# Altium project MainBoard.PrjPcb (part 1 of 2)
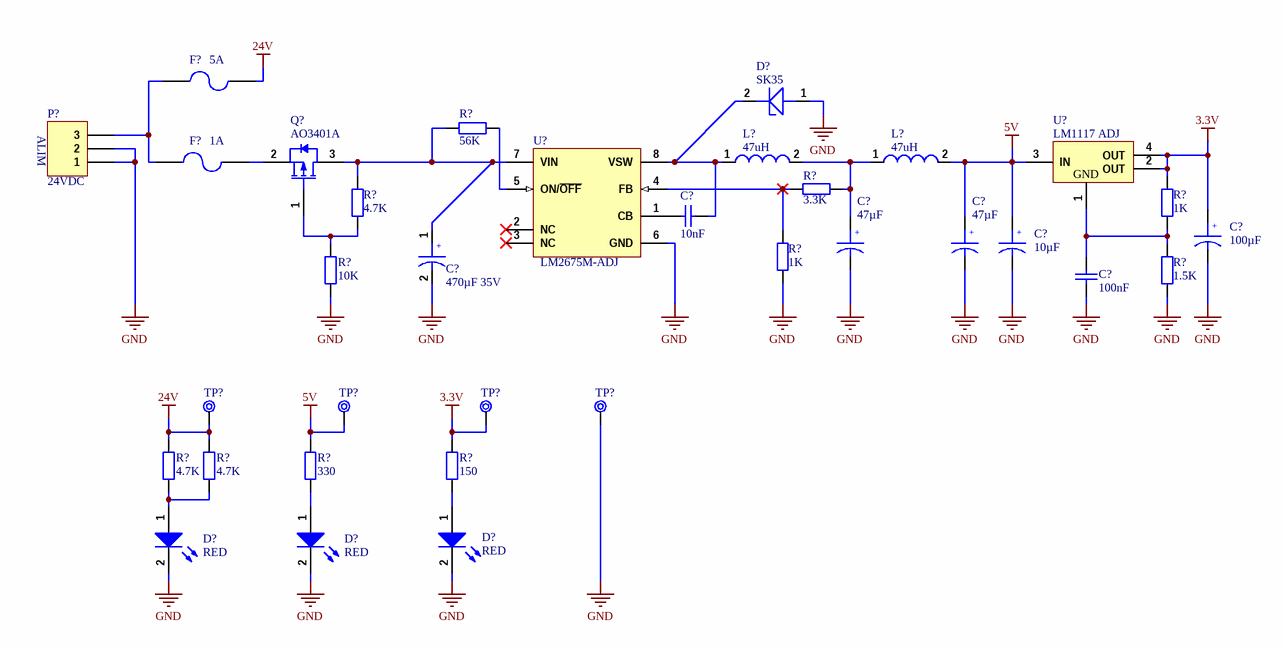
[diagram p0: PSU.SchDoc]
4 sheets, 97 parts. Net scope: flat (ports and power ports of the same name join across sheets).
Sheets:
  PSU.SchDoc
  AFFICHEUR.SchDoc
  MDB.SchDoc
  KEYBOARD.SchDoc

## Sheet PSU.SchDoc: POWER SUPPLY 3.3V
size A4; Date: 16 02 2016; Author: Rachid AKKOUCHE; CompanyName: RASoftware; DrawnBy: Rachid AKKOUCHE; Engineer: Rachid AKKOUCHE; Organization: RASoftware; Address1: 52J-03 rue de la crèche; Address3: 77100 MEAUX; Address4: FRANCE; DocumentNumber: BRA201909268; Revision: II; SheetNumber: 1; SheetTotal: 3; Dessinepar: Rachid AKKOUCHE; Property: RASoftware; Time: 08:00

### Parts
(Parts that share a designator on the sheet are numbered #1, #2 ... from top to bottom, then left to right.)
C?#1  10nF  [C 0805(2012)x0.65]
C?#2  100µF  [Kemet_63]
C?#3  470µF 35V  [KEMET_10]
C?#4  47µF  [CAP TANT 35X28]
C?#5  47µF  [CAP TANT 35X28]
C?#6  10µF  [KEMET_4 - 2]
C?#7  100nF  [C 0805(2012)x0.65]
D?#1  SK35  [SMA]
D?#2  Couleur: RED  [0603-LEDR]  (hidden comment: HSMH-C190)
D?#3  Couleur: RED  [0603-LEDR]  (hidden comment: HSMH-C190)
D?#4  Couleur: RED  [0603-LEDR]  (hidden comment: HSMH-C190)
F?#1  5A  [FUS5X20]
F?#2  1A  [FUS5X20]
L?#1  47uH  [Self DO3316P]
L?#2  47uH  [Self DO3316P]
P?#1  24VDC  [CO3P381 - RIGHT]
Q?#1  AO3401A  [SOT23]
R?#1  56K  [R 0805(2012)]
R?#2  4.7K  [R 0805(2012)]
R?#3  1K  [R 0805(2012)]
R?#4  3.3K  [R 0805(2012)]
R?#5  1K  [R 0805(2012)]
R?#6  10K  [R 0805(2012)]
R?#7  1.5K  [R 0805(2012)]
R?#8  4.7K  [R 0805(2012)]
R?#9  4.7K  [R 0805(2012)]
R?#10  330  [R 0805(2012)]
R?#11  150  [R 0805(2012)]
TP?#1  TEST PIN  [tp]  (value not drawn)
TP?#2  TEST PIN  [tp]  (value not drawn)
TP?#3  TEST PIN  [tp]  (value not drawn)  (no BOM)
TP?#4  TEST PIN  [tp]  (value not drawn)  (no BOM)
U?#1  LM1117 ADJ  [SOT223]
U?#2  LM2675M-ADJ  [SOIC8]

### Nets
3.3V: C?#2.1 R?#3.2 R?#11.2 TP?#3.1 U?#1.2(OUT) U?#1.4(OUT)
5V: C?#5.1 C?#6.1 L?#2.2 R?#10.2 TP?#2.1 U?#1.3(IN)
24V: F?#1.2 R?#8.2 R?#9.2 TP?#1.1
GND: C?#2.2 C?#3.2 C?#4.2 C?#5.2 C?#6.2 C?#7.1 D?#1.1(ANOD) D?#2.2(K) D?#3.2(K) D?#4.2(K) P?#1.1 P?#1.2 R?#5.1 R?#6.1 R?#7.1 TP?#4.1 U?#2.6(GND)
NetC?#1_1: C?#1.1 D?#1.2(CATH) L?#1.1 U?#2.8(VSW)
NetC?#1_2: C?#1.2 U?#2.1(CB)
NetC?#3_1: C?#3.1 Q?#1.3(D) R?#1.1 R?#2.2 U?#2.7(VIN)
NetC?#4_1: C?#4.1 L?#1.2 L?#2.1 R?#4.1
NetC?#7_2: C?#7.2 R?#3.1 R?#7.2 U?#1.1(GND)
NetD?#2_1: D?#2.1(A) R?#8.1 R?#9.1
NetD?#3_1: D?#3.1(A) R?#10.1
NetD?#4_1: D?#4.1(A) R?#11.1
NetF?#1_1: F?#1.1 F?#2.1 P?#1.3
NetF?#2_2: F?#2.2 Q?#1.2(S)
NetQ?#1_1: Q?#1.1(G) R?#2.1 R?#6.2
NetR?#1_2: R?#1.2 U?#2.5(ON/~{OFF})
NetR?#4_2: R?#4.2 R?#5.2 U?#2.4(FB)

Not connected (* = marked no-connect by the designer): U?#2 2(NC)* 3(NC)*

### Notes on the sheet
- (near P?#1) ALIM
- Project:
- Il ne peut être divulgué sans l'accord écrit de l'un de ses représentants dûment mandaté
- Ce document est la propriété de
- Title:
- Number:
- Date:
- Time:
- Size:
- A4
- Revision:
- Sheet
- of
- 2, rue Georges MELIES
- Draw by:
- 78390 BOIS D'ARCY
- (in symbol Cap Pol 10µF) +
- (in symbol Cap Pol 100µF) +
- (in symbol Cap Pol 470 µf) +
- (in symbol Cap tantale 47µF) +

### Library data of the parts
C?#1 = Cap 0805 10nF: Capacitor 10nF; Manufacturer: AVX; Manufacturer Part Number: 0402YC103KAT2A; Unit: pcs; SuppliedAmount: 0; MinAmount: 200; Multiples: 100; Type de condensateur: céramique; Tye de condensateur: MLCC; Tension de travail: 16V; Diélectrique: X7R; Tolérance: ±10%; Montage: SMD; Boîtier: 0402; Température de travail: -55...125°C; Supplier Part Number 1: 0402YC103KAT2A; ComponentLink1URL: http://www.tme.eu/fr/details/0402yc103kat2a/condensateurs-mlcc-smd-0402/avx/; ComponentLink1Description: http://www.tme.eu/fr/details/0402yc103kat2a/condensateurs-mlcc-smd-0402/avx/; Category: Condensateurs MLCC SMD 0402; Stock: 41500; Weight: 0,014; Price Type: NET; Capacité: 10nF; Fabricant: AVX; Supplier 1: TME
C?#2 = Cap Pol 100µF: Polarized Capacitor; Manufacturer: EPCOS; Manufacturer Part Number: B41142A4107M; Product Range: EPCOS - B41142 Series; Capacité: 100; Tolérance de capacité: ± 20%; Tension: 16; Type de boîtier de condensateur: Radial Can - SMD; Diamètre: 6.3; Résistance, ESR: 0.16; Hauteur: 7.7; Courant d'ondulation c.a.: 300; Type de packaging: Cut Tape; Durée de vie @ température: 2000 heures @ 105; Température d'utilisation min: -55; Température de fonctionnement max..: 105; SVHC: No SVHC (19-Dec-2012); Impédance: 0.26; Température de fonctionnement: -55°C à +105; Température, ESR: 20; Type de boîtier: CMS; Supplier 1: Farnell; RoHS: YES; Pricing 1: 10=0,123, 50=0,095, 100=0,078, 250=0,07, 1000=0,062 (EUR); Courant d'ondulation c.a. à  100Hz: 300; Fréquence, impédance: 100; Longueur/hauteur: 7.7; Température, courant ondulatoire: 105; Température, impédance: 20; ComponentLink1URL: http://www.epcos.com/inf/20/30/db/alu_x/B41142.pdf; ComponentLink1Description: http://www.epcos.com/inf/20/30/db/alu_x/B41142.pdf; Supplier Part Number 1: 1735328
C?#3 = Cap Pol 470 µf: Polarized capacitor; Manufacturer: Panasonic; Manufacturer Part Number: EEV-FK1V471Q; Material: Aluminium; Capacitance: 470uF; Tolerance: 20%; Ripple Current (AC): 1.1A; Impedance: 60mR; Life (Hours): 5000Hour; Leakage Current: 3uA; Dissipation Factor: 0.12%; ComponentLink1URL: http://www.farnell.com/datasheets/1680956.pdf; ComponentLink1Description: http://www.farnell.com/datasheets/1680956.pdf; Supplier 1: Farnell; Stock 1: 0; Mount: Surface Mount,PCB; Case/Package: Radial; Contact Plating: Tin; Min Operating Temperature: -55°C; Max Operating Temperature: 105°C; Voltage Rating: 35V; Packaging: Tape and Reel; Ripple Current: 1.1A; Package Quantity: 200; Voltage Rating (DC): 35V; ESR (Equivalent Series Resistance): 60mR; Termination: SMD/SMT; Voltage: 35V; Diameter: 12.5mm; Length: 13.5mm; Height: 13.5mm; Height - Seated (Max): 0.531inch; Width: 900um; Radiation Hardening: No; REACH SVHC: No SVHC; Lead Free: Lead Free; ComponentLink2URL: https://datasheet.ciiva.com/11783/0900766b80e4e8b0-11783536.pdf; ComponentLink2Description: https://datasheet.ciiva.com/11783/0900766b80e4e8b0-11783536.pdf; ComponentLink3URL: https://datasheet.ciiva.com/29313/443482-da-01-en-smd-elko-vfk-h13-470-uf-35v-29313589.pdf; ComponentLink3Description: https://datasheet.ciiva.com/29313/443482-da-01-en-smd-elko-vfk-h13-470-uf-35v-29313589.pdf; ComponentLink4URL: https://datasheet.ciiva.com/48483/aba0000ce120-48483341.pdf; ComponentLink4Description: https://datasheet.ciiva.com/48483/aba0000ce120-48483341.pdf; ComponentLink5URL: https://datasheet.ciiva.com/30252/eev-fkseries-30252141.pdf; ComponentLink5Description: https://datasheet.ciiva.com/30252/eev-fkseries-30252141.pdf; ComponentLink6URL: https://datasheet.ciiva.com/15225/getdatasheetpartid-199809-15225692.pdf; ComponentLink6Description: https://datasheet.ciiva.com/15225/getdatasheetpartid-199809-15225692.pdf; ComponentLink7URL: https://datasheet.ciiva.com/14599/70258115-14599980.pdf; ComponentLink7Description: https://datasheet.ciiva.com/14599/70258115-14599980.pdf; ComponentLink8URL: https://datasheet.ciiva.com/28692/1676921-28692730.pdf; ComponentLink8Description: https://datasheet.ciiva.com/28692/1676921-28692730.pdf; ComponentLink9URL: https://datasheet.ciiva.com/14592/70258115-14592362.pdf; ComponentLink9Description: https://datasheet.ciiva.com/14592/70258115-14592362.pdf; ComponentLink10URL: https://datasheet.ciiva.com/14592/70068597-14592122.pdf; ComponentLink10Description: https://datasheet.ciiva.com/14592/70068597-14592122.pdf; ComponentLink11URL: https://datasheet.ciiva.com/2984/aba0000ce120-2984090.pdf; ComponentLink11Description: https://datasheet.ciiva.com/2984/aba0000ce120-2984090.pdf; ComponentLink12URL: https://datasheet.ciiva.com/8081/1676921-8081433.pdf; ComponentLink12Description: https://datasheet.ciiva.com/8081/1676921-8081433.pdf; ComponentLink13URL: https://datasheet.ciiva.com/46379/1676921-46379192.pdf; ComponentLink13Description: https://datasheet.ciiva.com/46379/1676921-46379192.pdf; ComponentLink14URL: https://datasheet.ciiva.com/24229/aba0000ce120-24229287.pdf; ComponentLink14Description: https://datasheet.ciiva.com/24229/aba0000ce120-24229287.pdf; ComponentLink15URL: https://datasheet.ciiva.com/31417/1676921-31417910.pdf; ComponentLink15Description: https://datasheet.ciiva.com/31417/1676921-31417910.pdf; ComponentLink16URL: https://datasheet.ciiva.com/43470/1676921-43470869.pdf; ComponentLink16Description: https://datasheet.ciiva.com/43470/1676921-43470869.pdf; ComponentLink17URL: https://datasheet.ciiva.com/17355/aba0000ce120-17355694.pdf; ComponentLink17Description: https://datasheet.ciiva.com/17355/aba0000ce120-17355694.pdf; ComponentLink18URL: https://datasheet.ciiva.com/46372/1676921-46372495.pdf; ComponentLink18Description: https://datasheet.ciiva.com/46372/1676921-46372495.pdf; Supplier Part Number 1: 2326374RL
C?#4 C?#5 = Cap tantale 47µF: Capacitor tantale 47µF; Manufacturer: KEMET; Manufacturer Part Number: T491B106K020AT; Dielectric Material: Tantalum; Capacitance: 10uF; Tolerance: 10%; ESR (Equivalent Series Resistance): 2.1R; Voltage Rating: 20V; Ripple Current: 201mA; Leakage Current: 2uA; Polarity: Polar; Dissipation Factor: 6%; Life (Hours): 2000Hour; RoHS: Yes; Mount: Surface Mount,PCB; Case/Package: 1411; Number of Pins: 2; Weight: 0.002293oz; Case Code (Metric): 3528; Case Code (Imperial): 1411; Min Operating Temperature: -55°C; Max Operating Temperature: 125°C; Packaging: Tape and Reel; Package Quantity: 1; Voltage Rating (DC): 20V; Termination: SMD/SMT; Failure Rate: 0.001%; Voltage: 20V; Features: General Purpose; Length: 3.5mm; Height: 1.9mm; Width: 2.8mm; Height - Seated (Max): 0.083inch; Depth: 2.8mm; Radiation Hardening: No; REACH SVHC: No SVHC; Lead Free: Lead Free; ComponentLink1URL: https://datasheet.ciiva.com/34302/1573513-34302517.pdf?src-supplier=Jameco; ComponentLink1Description: https://datasheet.ciiva.com/34302/1573513-34302517.pdf?src-supplier=Jameco; ComponentLink2URL: https://datasheet.ciiva.com/11793/0900766b80718482-11793045.pdf?src-supplier=RSComponents; ComponentLink2Description: https://datasheet.ciiva.com/11793/0900766b80718482-11793045.pdf?src-supplier=RSComponents; ComponentLink3URL: https://datasheet.ciiva.com/5933/1446014-5933945.pdf?src-supplier=Farnell; ComponentLink3Description: https://datasheet.ciiva.com/5933/1446014-5933945.pdf?src-supplier=Farnell; ComponentLink4URL: https://datasheet.ciiva.com/5934/kem-t2005-t491-5934250.pdf?src-supplier=Farnell; ComponentLink4Description: https://datasheet.ciiva.com/5934/kem-t2005-t491-5934250.pdf?src-supplier=Farnell; ComponentLink5URL: https://datasheet.ciiva.com/18095/getdatasheetpartid-74405-18095116.pdf?src-supplier=Verical; ComponentLink5Description: https://datasheet.ciiva.com/18095/getdatasheetpartid-74405-18095116.pdf?src-supplier=Verical; ComponentLink6URL: https://datasheet.ciiva.com/7851/1854511-7851182.pdf?src-supplier=Element14; ComponentLink6Description: https://datasheet.ciiva.com/7851/1854511-7851182.pdf?src-supplier=Element14; ComponentLink7URL: https://datasheet.ciiva.com/7851/1854511-7851183.pdf?src-supplier=Element14; ComponentLink7Description: https://datasheet.ciiva.com/7851/1854511-7851183.pdf?src-supplier=Element14; ComponentLink8URL: https://datasheet.ciiva.com/6228/kem-t2005-t491-6228165.pdf?src-supplier=Digi-Key; ComponentLink8Description: https://datasheet.ciiva.com/6228/kem-t2005-t491-6228165.pdf?src-supplier=Digi-Key; ComponentLink9URL: https://datasheet.ciiva.com/12911/kem-t2005-t491-12911733.pdf?src-supplier=Mouser; ComponentLink9Description: https://datasheet.ciiva.com/12911/kem-t2005-t491-12911733.pdf?src-supplier=Mouser; ComponentLink10URL: https://datasheet.ciiva.com/8080/kem-t2005-t491-8080268.pdf?src-supplier=Element14; ComponentLink10Description: https://datasheet.ciiva.com/8080/kem-t2005-t491-8080268.pdf?src-supplier=Element14
C?#6 = Cap Pol 10µF: Polarized Capacitor; Manufacturer: KEMET; Manufacturer Part Number: EXV106M025A9BAA; Supplier 1: Farnell; Supplier Part Number 1: 2069174; RoHS: YES; Pricing 1: 10=0,111, 100=0,085, 500=0,074, 1000=0,07, 5000=0,066 (EUR); ComponentLink1URL: http://www.farnell.com/datasheets/1500293.pdf; ComponentLink1Description: http://www.farnell.com/datasheets/1500293.pdf
C?#7 = Cap 0805 100nF: Capacitor; Manufacturer: MULTICOMP; Manufacturer Part Number: MCCA000296; Supplier 1: Farnell; Supplier Part Number 1: 1759167; Pricing 1: 100=0,01, 500=0,008, 1000=0,006, 4000=0,005 (EUR); ComponentLink1URL: http://www.farnell.com/datasheets/1520827.pdf; ComponentLink1Description: http://www.farnell.com/datasheets/1520827.pdf
D?#1 = SS14: Diode schottky 50V 3A; Manufacturer 1: Fairchild Semiconductor; Description 1: DIODE SCHOTTKY 40V 1A SMA; Forward Current: 1; Max Repetitive Reverse Voltage (Vrrm): 40; Element Configuration: Single; Forward Voltage: 500; Peak Reverse Current: 200; Polarity: Standard; Max Power Dissipation: 1.1; Supplier 1: Farnell; Supplier Part Number 1: 1467537RL; Manufacturer Part Number 1: SS14; Stock 1: 21745; Pricing 1: 1=0.305, 80=0.104, 300=0.0774, 700=0.0561, 2000=0.051, 6000=0.0478 (GBP); Mount: Surface Mount; Case/Package: SMA; Number of Pins: 2; Weight: 0.003739; Number of Terminals: 2; Min Operating Temperature: -65; Max Operating Temperature: 125; Packaging: Tape and Reel; Package Quantity: 7500; Max Forward Surge Current (Ifsm): 40; Current Rating: 1; Peak Non-Repetitive Surge Current: 40; Termination: SMD/SMT; Voltage Rating (DC): 40; Reverse Voltage (DC): 40; Average Rectified Current: 1; Output Current: 1; Current: 1; Voltage: 40; Number of Elements: 1; Power Dissipation: 1.1; Length: 4.75; Height: 2.2; Width: 2.95; Radiation Hardening: No; REACH SVHC: No SVHC; Lead Free: Lead Free; ComponentLink1URL: https://datasheet.ciiva.com/16744/ss14-16744879.pdf; ComponentLink1Description: https://datasheet.ciiva.com/16744/ss14-16744879.pdf; ComponentLink2URL: https://datasheet.ciiva.com/34301/1089027-34301973.pdf; ComponentLink2Description: https://datasheet.ciiva.com/34301/1089027-34301973.pdf; ComponentLink3URL: https://datasheet.ciiva.com/4713/ss14-197224-4713938.pdf; ComponentLink3Description: https://datasheet.ciiva.com/4713/ss14-197224-4713938.pdf; ComponentLink4URL: https://datasheet.ciiva.com/7965/1766303-7965241.pdf; ComponentLink4Description: https://datasheet.ciiva.com/7965/1766303-7965241.pdf; ComponentLink5URL: https://datasheet.ciiva.com/910/ss12-910696.pdf; ComponentLink5Description: https://datasheet.ciiva.com/910/ss12-910696.pdf; ComponentLink6URL: https://datasheet.ciiva.com/22651/1880990-22651980.pdf; ComponentLink6Description: https://datasheet.ciiva.com/22651/1880990-22651980.pdf; ComponentLink7URL: https://datasheet.ciiva.com/910/ss12-910697.pdf; ComponentLink7Description: https://datasheet.ciiva.com/910/ss12-910697.pdf; ComponentLink8URL: https://datasheet.ciiva.com/8303/ss19-8303766.pdf; ComponentLink8Description: https://datasheet.ciiva.com/8303/ss19-8303766.pdf; ComponentLink9URL: https://datasheet.ciiva.com/910/ss12-910695.pdf; ComponentLink9Description: https://datasheet.ciiva.com/910/ss12-910695.pdf; ComponentLink10URL: https://datasheet.ciiva.com/25951/ss19-25951496.pdf; ComponentLink10Description: https://datasheet.ciiva.com/25951/ss19-25951496.pdf
D?#2-D?#4 = HSMH-C190: Surface Mount Chip LED, Red; Manufacturer: AVAGO TECHNOLOGIES; Manufacturer Part Number: HSMH-C190.; Taille de lampe: 0.8mm x 1; Couleur de LED: Rouge; Intensité lumineuse: 17; Angle, vision: 170°; Courant, direct, If: 20; Tension, direct à  If: 1.8; Montage LED: CMS; Forme de lentille: Rectangulaire; Longueur d'onde typ.: 626; SVHC: No SVHC (19-Dec-2012); Dissipation de puissance: 65; Intensité lumineuse min. à  If: 2.8; Intensité lumineuse typique: 10; Largeur (externe): 0.8; Longueur d'onde dominante: 639; Longueur d'onde, crête: 630; Longueur/hauteur: 1.6; Matière: AlGaAs; Nombre de broches: 2; Orientation de montage opto: Dessus; Orientation sortie de lumière: Top Emitting; Température de fonctionnement: -30°C à +85; Température de fonctionnement max..: 85; Température, stockage min.: -40; Température d'utilisation min: -30; Tension, Vf max..: 2.6; Tension, Vf min.: 2.1; Type de LED: Standard; Supplier 1: Farnell; Supplier Part Number 1: 8554641; RoHS: YES; Stock 1: 13902; Pricing 1: 5=0,06, 25=0,059, 100=0,057, 250=0,052, 500=0,047 (EUR); MSL: MSL 2A - 4 semaines; Couleur, LED: Rouge; Profondeur: 0.8; Température, stockage max..: 85; Tension, Vf typ.: 1.8; ComponentLink1URL: http://www.farnell.com/datasheets/313031.pdf; ComponentLink1Description: http://www.farnell.com/datasheets/313031.pdf; ComponentLink2URL: http://www.farnell.com/datasheets/55927.pdf; ComponentLink2Description: http://www.farnell.com/datasheets/55927.pdf
F?#1 F?#2 = Fuse 2: Fuse; Manufacturer: KEYSTONE; Manufacturer Part Number: 4527; Fusible 5X20: 1123209; Published: 8-Jun-2000; LatestRevisionDate: 17-Jul-2002; LatestRevisionNote: Re-released for DXP Platform.; PackageReference: PIN-W2/E2.8; Publisher: Altium Limited; PackageDescription: Thru-Hole; 2 Leads; Supplier 1: Farnell; Supplier Part Number 1: 2301274+2301275+1123183; RoHS: YES; Pricing 1: 1=0,59, 250=0,45, 500=0,4, 1000=0,36, 5000=0,33 (EUR); ComponentLink1URL: http://www.keyelco.com/userAssets/file/M60p42.pdf; ComponentLink1Description: http://www.keyelco.com/userAssets/file/M60p42.pdf
L?#1 L?#2 = SELF: Manufacturer: COILCRAFT; Manufacturer Part Number: DO3316P-473MLD; Product Range: DO3316; Inductance: 47; RMS Current (Irms): 1.8; Saturation Current (Isat): 1.6; Inductor Construction: Unshielded; DC Resistance Max: 0.14; Power Inductor Case: 12.95mm x 9.4mm x 5.21; Inductance Tolerance: ± 20%; SVHC: No SVHC (12-Jan-2017); Self Resonant Frequency Min: 12MHz<!--FANDB--><div class="features-and-benefits-container"><div class="features-and-benefits-description"><span class="features-benefits-value">The DO3316P-473MLD is a surface mount unshielded Power Inductor with ferrite core. This inductor features gold over nickel over phosphor bronze terminations and is resistance to soldering heat maximum three 40 seconds reflows at +260°C, parts cooled to room temperature between cycles. This inductor also features moisture sensitivity level (MSL) of 1, failures in time (FIT)/mean time between failures (MTBF) is 38 per billion hours/26,315,789 hours, calculated per Telcordia SR-332 and only pure water or alcohol recommended for wash. Current at 25°C causes an inductance drop of 10% typical from its value without current. ±20; Supplier 1: Farnell; Supplier Part Number 1: 2287252; RoHS: YES; Stock 1: 2601; Pricing 1: 1=0.981, 500=0.722 (GBP); Packaging: Cut Tape; ComponentLink1URL: http://www.farnell.com/datasheets/1681904.pdf; ComponentLink1Description: http://www.farnell.com/datasheets/1681904.pdf
P?#1 = Header 3: Header, 3-Pin; Manufacturer: TE CONNECTIVITY / BUCHANAN; Manufacturer Part Number: 796636-3; LatestRevisionDate: 17-Jul-2002; LatestRevisionNote: Re-released for DXP Platform.; Publisher: Altium Limited; Supplier 1: Farnell; Supplier Part Number 1: 2059780; RoHS: YES; Pricing 1: 10=0,68, 100=0,51, 500=0,43, 1000=0,36, 2000=0,35, 5000=0,33 (EUR); ComponentLink1URL: http://www.farnell.com/cad/1652960.pdf; ComponentLink1Description: http://www.farnell.com/cad/1652960.pdf; ComponentLink2URL: http://www.farnell.com/datasheets/1650926.pdf; ComponentLink2Description: http://www.farnell.com/datasheets/1650926.pdf
Q?#1 = AO3401A: MOSFET P-CH 30V 4A SOT23; Manufacturer: Alpha & Omega Semiconductor; Rds On Max: 44mR; Input Capacitance: 1.2nF; Max Power Dissipation: 1.4W; Number of Elements: 1; Supplier 1: Arrow Electronics; Manufacturer Part Number: AO3401A; RoHS: Yes; Category: MOSFETs; Pricing 1: 6000=0,07860, 15000=0,06960, 30000=0,06870, 75000=0,05840, 150000=0,05610, 6000=0,08240, 60000=0,07800, 600000=0,05360, 3000000=0,04250, 6000000=0,04240 (USD); Mount: Surface Mount; Case/Package: TO-236-3; Number of Pins: 3; Min Operating Temperature: -55°C; Max Operating Temperature: 150°C; Packaging: Tape and Reel; Drain to Source Voltage (Vdss): 30V; Continuous Drain Current (ID): 4A; Power Dissipation: 1.4W; Series: -; Radiation Hardening: No; Lead Free: Lead Free; RoHS Compliant: Yes; ComponentLink1URL: https://datasheet.ciiva.com/940/ao3401a-940720.pdf?src-supplier=Digi-Key; ComponentLink1Description: https://datasheet.ciiva.com/940/ao3401a-940720.pdf?src-supplier=Digi-Key; ComponentLink2URL: https://datasheet.ciiva.com/26927/getdatasheetpartid-79048-26927888.pdf?src-supplier=Verical; ComponentLink2Description: https://datasheet.ciiva.com/26927/getdatasheetpartid-79048-26927888.pdf?src-supplier=Verical; Supplier Part Number 1: AO3401A
R?#1 = Resistor 0805 56K: Resistor SMD 0805 56K; Manufacturer: MULTICOMP; Manufacturer Part Number: MC0.1W08051%56KFR; Product Range: MULTICOMP - MC Series; Résistance: 56; Puissance: 100; Tolérance de résistance: ± 1%; Type de boîtier de résistance: 0805; Type de résistance: Couche épaisse; Coefficient de température: ± 100; Tension: 150; Type de packaging: Full Reel; Resistor Mounting: CMS; Resistor Terminals: (Non Disponible); Supplier 1: Farnell; RoHS: YES; Pricing 1: 5000=0,001 (EUR); MSL: (Non Applicable); ComponentLink1URL: http://www.farnell.com/datasheets/1716700.pdf; ComponentLink1Description: http://www.farnell.com/datasheets/1716700.pdf; Supplier Part Number 1: 2129258
R?#2 R?#8 R?#9 = Resistor 0805 4.7K: Resistor SMD 0805 4.7K; Manufacturer: MULTICOMP; Manufacturer Part Number: MC01W080514K7; Product Range: MULTICOMP - MC Series; Résistance: 4.7; Puissance: 100; Tolérance de résistance: ± 1%; Type de boîtier de résistance: 0805; Type de résistance: Couche épaisse; Coefficient de température: ± 100; Tension: 150; Type de packaging: Full Reel; SVHC: No SVHC (20-Jun-2013); Resistor Mounting: CMS; Supplier 1: Farnell; RoHS: YES; Pricing 1: 5000=0,001 (EUR); MSL: (Non Applicable); ComponentLink1URL: http://www.farnell.com/datasheets/1729047.pdf; ComponentLink1Description: http://www.farnell.com/datasheets/1729047.pdf; Supplier Part Number 1: 2129167
R?#3 R?#5 = Resistor 0805 1K: Resistor SMD 0805 1K; Manufacturer: MULTICOMP; Manufacturer Part Number: MC0.1W08051%1KFR; Product Range: MULTICOMP - MC Series; Résistance: 1; Puissance: 100; Tolérance de résistance: ± 1%; Type de boîtier de résistance: 0805; Type de résistance: Couche épaisse; Coefficient de température: ± 100; Tension: 150; Type de packaging: Full Reel; Resistor Mounting: CMS; ComponentLink1URL: http://www.farnell.com/datasheets/1716700.pdf; ComponentLink1Description: http://www.farnell.com/datasheets/1716700.pdf; Supplier 1: Farnell; RoHS: YES; Pricing 1: 5000=0,001 (EUR); MSL: MSL 1 - Illimité; Supplier Part Number 1: 2129113
R?#4 = Resistor 0805 3.3K: Resistor SMD 0805 3.3K; Manufacturer: BOURNS; Manufacturer Part Number: CR0805-FX-2201ELF; Resistance: 3.3kR; Power Rating: 125mW; Tolerance: 1%; Voltage Rating: 150V; Temperature Coefficient: 100ppm/°C; Supplier 1: Farnell; RoHS: YES; Stock 1: 2028; Pricing 1: 10=0.035, 100=0.0233, 500=0.0162, 1000=0.0141, 2500=0.012, 5000=0.0105, 25000=0.0065 (GBP); ComponentLink1URL: http://www.bourns.com/engineering/CHPREZTR/cr0805.stp; ComponentLink1Description: http://www.bourns.com/engineering/CHPREZTR/cr0805.stp; ComponentLink2URL: http://www.farnell.com/datasheets/2178762.pdf; ComponentLink2Description: http://www.farnell.com/datasheets/2178762.pdf; Supplier Part Number 1: 2333585; Supplier 2: Farnell; Stock 2: 0; Pricing 2: 150=0.004, 500=0.0029, 1000=0.0022, 2500=0.0018 (EUR); Mount: Surface Mount; Case/Package: 0805; Case Code (Metric): 2012; Case Code (Imperial): 0805; Packaging: Tape and Reel; Composition: Thick Film; Voltage Rating (DC): 150V; REACH SVHC: Unknown; ComponentLink3URL: https://datasheet.ciiva.com/46398/1849611-46398597.pdf; ComponentLink3Description: https://datasheet.ciiva.com/46398/1849611-46398597.pdf; Supplier Part Number 2: 2447651RL
R?#6 = Resistor 0805 10K: Resistor SMD 0805 10K; Manufacturer: MULTICOMP; Manufacturer Part Number: MC0.1W08051%10KFR; Product Range: MULTICOMP - MC Series; Résistance: 10; Puissance: 100; Tolérance de résistance: ± 1%; Type de boîtier de résistance: 0805; Type de résistance: Couche épaisse; Coefficient de température: ± 100; Tension: 150; Type de packaging: Full Reel; Resistor Mounting: CMS; Supplier 1: Farnell; RoHS: YES; Pricing 1: 5000=0,001 (EUR); MSL: MSL 1 - Illimité; ComponentLink1URL: http://www.farnell.com/datasheets/1716700.pdf; ComponentLink1Description: http://www.farnell.com/datasheets/1716700.pdf; Supplier Part Number 1: 2129195
R?#7 = Resistor 0805 1.5K: Resistor SMD 0805 1.5K; Power Rating: 125mW; Resistance: 1.5kR; Temperature Coefficient: 100ppm/°C; Tolerance: 1%; Voltage Rating: 150V; Case Code (Imperial): 0805; Case Code (Metric): 2012; Case/Package: 0805; Composition: Thick Film; Mount: Surface Mount; Packaging: Tape and Reel; REACH SVHC: Unknown; Voltage Rating (DC): 150V; Supplier 1: Farnell; Supplier Part Number 1: 2446909
R?#10 = Resistor 0805 330: Resistor SMD 0805 330; Manufacturer: YAGEO; Manufacturer Part Number: RC0805JR-07330RL; Unit: pcs; SuppliedAmount: 0; MinAmount: 100; Resistance: 330Ω; Power: 0.125W; Tolerance: ±5%; Max. operating voltage: 150V; Max. overload voltage: 300V; Supplier 1: TME; Category: 0805 SMD Resistors; Stock 1: 0; Pricing 1: 100=0.00553, 1000=0.00332, 5000=0.00109, 15000=0.001, 50000=0.00086 (EUR); Weight: 0.027; Multiples: 100; Resistor type: thick film; Mounting: SMD; Case: 0805; Operating temperature: -55...155°C; Price Type: NET; ComponentLink1URL: http://static.tme.eu/products_pics/6/6/c/66cc5cd64257edd80ca8e9fd2040972d/56038.jpg; ComponentLink1Description: http://static.tme.eu/products_pics/6/6/c/66cc5cd64257edd80ca8e9fd2040972d/56038.jpg; Supplier Part Number 1: RC0805JR-07330R
R?#11 = Resistor 0805 150: Resistor SMD 0805 150; Manufacturer: YAGEO; Manufacturer Part Number: RC0805JR-07150KL; Unit: pcs; SuppliedAmount: 0; MinAmount: 100; Resistance: 150kΩ; Power: 0.125W; Tolerance: ±5%; Max. operating voltage: 150V; Max. overload voltage: 300V; Supplier 1: TME; Category: 0805 SMD Resistors; Stock 1: 6800; Pricing 1: 100=0.00566, 1000=0.0034, 5000=0.00111, 15000=0.00102, 50000=0.00088 (EUR); Weight: 0.028; Multiples: 100; Resistor type: thick film; Mounting: SMD; Case: 0805; Operating temperature: -55...155°C; Price Type: NET; ComponentLink1URL: http://static.tme.eu/products_pics/6/6/c/66cc5cd64257edd80ca8e9fd2040972d/56038.jpg; ComponentLink1Description: http://static.tme.eu/products_pics/6/6/c/66cc5cd64257edd80ca8e9fd2040972d/56038.jpg; Supplier Part Number 1: RC0805JR-07150K
TP?#1 = TEST PIN: Point de test 12/485
TP?#2 = TEST PIN: Point de test 12
TP?#3 TP?#4 = TEST PIN: Point de test 3.3
U?#1 = LM1117DT-ADJ: 800mA Adjustable low-Dropout Linear Regulator, 3-pin TO-252; ComponentLink1URL: http://www.ti.com/lit/ds/symlink/tlv1117.pdf; ComponentLink1Description: http://www.ti.com/lit/ds/symlink/tlv1117.pdf; ComponentLink2URL: http://www.farnell.com/cad/1614300.zip; ComponentLink2Description: http://www.farnell.com/cad/1614300.zip
U?#2 = LM2675M-ADJ: SIMPLE SWITCHER® Power Converter High Efficiency 1A Step-Down Voltage Regulator, 8-pin Narrow SOIC; Manufacturer: Texas Instruments; Manufacturer Part Number: LM2675MX-ADJNOPB; Output Voltage: 37V; Number of Outputs: 1; Switching Frequency: 260kHz; Quiescent Current: 2.5mA; ComponentLink1Description: LM2675 Datasheet; ComponentLink1URL: http://www.national.com/ds/LM/LM2675.pdf; ComponentLink2Description: LM2675 Web Page; ComponentLink2URL: http://www.national.com/pf/LM/LM2675.html; ComponentLink3Description: M08A Package Page; ComponentLink3URL: http://www.national.com/packaging/folders/m08a.html; Supplier 1: Farnell; Stock 1: 0; Case/Package: SOIC N; Number of Pins: 8; Packaging: Cut Tape; Output Current: 1A; Lead Free: Lead Free; ComponentLink4URL: http://www.ti.com/lit/ds/symlink/lm2675.pdf; ComponentLink4Description: http://www.ti.com/lit/ds/symlink/lm2675.pdf; ComponentLink5URL: http://www.ti.com/lit/gpn/lm2675; ComponentLink5Description: http://www.ti.com/lit/gpn/lm2675; Supplier Part Number 1: 2411988

## Sheet AFFICHEUR.SchDoc: DISPLAY
size A4; Date: 16 02 2016; Author: Rachid AKKOUCHE; DrawnBy: Rachid AKKOUCHE; Engineer: Rachid AKKOUCHE; DocumentNumber: BRA201909267; Revision: II; SheetNumber: 2; SheetTotal: 3; Dessinepar: Rachid AKKOUCHE; Property: Rachid AKKOUCHE; Time: 08:00
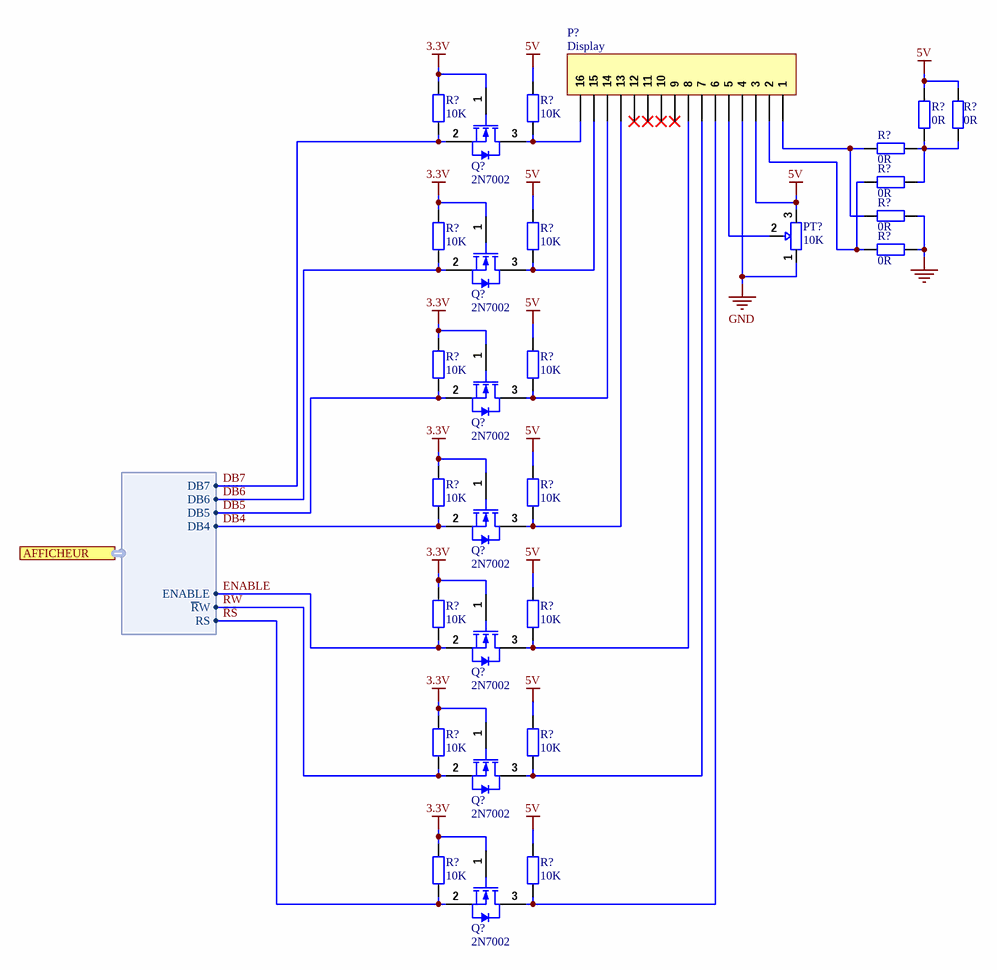
[diagram p1: AFFICHEUR.SchDoc]

### Parts
(Parts that share a designator on the sheet are numbered #1, #2 ... from top to bottom, then left to right.)
P?#2  Display  [MOLEX 22112162]
PT?  10K  [3361P]
Q?#2  2N7002  [SOT23]
Q?#3  2N7002  [SOT23]
Q?#4  2N7002  [SOT23]
Q?#5  2N7002  [SOT23]
Q?#6  2N7002  [SOT23]
Q?#7  2N7002  [SOT23]
Q?#8  2N7002  [SOT23]
R?#12  0R  [R 0805(2012)]
R?#13  0R  [R 0805(2012)]
R?#14  10K  [R 0805(2012)]
R?#15  10K  [R 0805(2012)]
R?#16  0R  [R 0805(2012)]
R?#17  0R  [R 0805(2012)]  (no BOM)
R?#18  0R  [R 0805(2012)]  (no BOM)
R?#19  10K  [R 0805(2012)]
R?#20  10K  [R 0805(2012)]
R?#21  0R  [R 0805(2012)]
R?#22  10K  [R 0805(2012)]
R?#23  10K  [R 0805(2012)]
R?#24  10K  [R 0805(2012)]
R?#25  10K  [R 0805(2012)]
R?#26  10K  [R 0805(2012)]
R?#27  10K  [R 0805(2012)]
R?#28  10K  [R 0805(2012)]
R?#29  10K  [R 0805(2012)]
R?#30  10K  [R 0805(2012)]
R?#31  10K  [R 0805(2012)]

### Ports
AFFICHEUR (harness Display)

### Harnesses
Display: RS, ~{R}W, ENABLE, DB4, DB5, DB6, DB7

### Nets
3.3V: Q?#2.1(G) Q?#3.1(G) Q?#4.1(G) Q?#5.1(G) Q?#6.1(G) Q?#7.1(G) Q?#8.1(G) R?#14.2 R?#19.2 R?#22.2 R?#24.2 R?#26.2 R?#28.2 R?#30.2
5V: P?#2.3 PT?.3 R?#12.1 R?#13.1 R?#15.2 R?#20.2 R?#23.2 R?#25.2 R?#27.2 R?#29.2 R?#31.2
GND: P?#2.4 PT?.1 R?#18.1 R?#21.1
DB4: Q?#5.2(S) R?#24.1 ; port AFFICHEUR.DB4
DB5: Q?#4.2(S) R?#22.1 ; port AFFICHEUR.DB5
DB6: Q?#3.2(S) R?#19.1 ; port AFFICHEUR.DB6
DB7: Q?#2.2(S) R?#14.1 ; port AFFICHEUR.DB7
ENABLE: Q?#6.2(S) R?#26.1 ; port AFFICHEUR.ENABLE
~{R}W: Q?#7.2(S) R?#28.1 ; port AFFICHEUR.~{R}W
RS: Q?#8.2(S) R?#30.1 ; port AFFICHEUR.RS
NetP?#2_1: P?#2.1 R?#16.2 R?#18.2
NetP?#2_2: P?#2.2 R?#17.2 R?#21.2
NetP?#2_5: P?#2.5 PT?.2
NetP?#2_6: P?#2.6 Q?#8.3(D) R?#31.1
NetP?#2_7: P?#2.7 Q?#7.3(D) R?#29.1
NetP?#2_8: P?#2.8 Q?#6.3(D) R?#27.1
NetP?#2_13: P?#2.13 Q?#5.3(D) R?#25.1
NetP?#2_14: P?#2.14 Q?#4.3(D) R?#23.1
NetP?#2_15: P?#2.15 Q?#3.3(D) R?#20.1
NetP?#2_16: P?#2.16 Q?#2.3(D) R?#15.1
NetR?#12_2: R?#12.2 R?#13.2 R?#16.1 R?#17.1

Not connected (* = marked no-connect by the designer): P?#2 9* 10* 11* 12*

### Notes on the sheet
- Ce document est la propriété de
- Project:
- Il ne peut être divulgué sans l'accord écrit de l'un de ses représentants dûment mandaté
- Title:
- Number:
- Date:
- Time:
- Size:
- A4
- Revision:
- Sheet
- of
- 2, rue Georges MELIES
- Draw by:
- 78390 BOIS D'ARCY

### Library data of the parts
P?#2 = Header 16: Header, 16-Pin; LatestRevisionDate: 17-Jul-2002; LatestRevisionNote: Re-released for DXP Platform.; Publisher: Altium Limited
PT? = RV: Manufacturer: BOURNS; Manufacturer Part Number: 3361P-1-103GLF; Supplier 1: Farnell; Supplier Part Number 1: 1696060; RoHS: YES; Pricing 1: 5=0,83, 50=0,77, 100=0,69, 250=0,65, 750=0,6 (EUR); ComponentLink1URL: http://www.farnell.com/datasheets/1563530.igs; ComponentLink1Description: http://www.farnell.com/datasheets/1563530.igs; ComponentLink2URL: http://www.farnell.com/datasheets/1733537.pdf; ComponentLink2Description: http://www.farnell.com/datasheets/1733537.pdf; ComponentLink3URL: http://www.farnell.com/cad/1563578.stp; ComponentLink3Description: http://www.farnell.com/cad/1563578.stp
Q?#2-Q?#8 = 2N7002: N-channel Enhancement Mode Field-effect Transistor; Continuous Drain Current (ID): 115mA; Drain to Source Breakdown Voltage: 60V; Drain to Source Resistance: 7.5R; Element Configuration: Single; Gate to Source Voltage (Vgs): 20V; Input Capacitance: 50pF; Max Power Dissipation: 225mW; Nominal Vgs: 2.5V; Number of Channels: 1; Power Dissipation: 300mW; Turn-Off Delay Time: 40ns; Turn-On Delay Time: 20ns; ComponentLink1URL: http://www.farnell.com/datasheets/660093.pdf; ComponentLink1Description: http://www.farnell.com/datasheets/660093.pdf; ComponentLink2URL: http://www.farnell.com/datasheets/410597.pdf; ComponentLink2Description: http://www.farnell.com/datasheets/410597.pdf; Case/Package: SOT-23-3; Contact Plating: Tin; Current Rating: 115mA; Drain to Source Voltage (Vdss): 60V; Halogen Free: Halogen Free; Height: 1.01mm; Lead Free: Lead Free; Length: 3.04mm; Max Operating Temperature: 150°C; Min Operating Temperature: -55°C; Number of Elements: 1; Number of Pins: 3; On-State Resistance: 7.5R; Package Quantity: 1; Packaging: Tape and Reel; Radiation Hardening: No; Rds On Max: 7.5R; REACH SVHC: No SVHC; Threshold Voltage: 2.5V; Voltage Rating (DC): 60V; Width: 1.4mm; Supplier 1: TME; Supplier Part Number 1: 2N7002LT1G
R?#12 R?#13 R?#16-R?#18 R?#21 = Resistor 0805 0R: Resistor or Jumper; Manufacturer: MULTICOMP; Manufacturer Part Number: MCMR08X000 PTL; Product Range: MULTICOMP - MCMR Series; Résistance: 0; Puissance: 125; Tolérance de résistance: ± 0.05; Type de boîtier de résistance: 0805; Type de résistance: Céramique; Coefficient de température: -200ppm/°C à +400; Tension: 150; Type de packaging: Cut Tape; Resistor Mounting: CMS; Supplier 1: Farnell; Supplier Part Number 1: 2073603; RoHS: YES; Pricing 1: 100=0,011, 500=0,009, 1000=0,008 (EUR); MSL: MSL 1 - Illimité; ComponentLink1URL: http://www.farnell.com/datasheets/1716708.pdf; ComponentLink1Description: http://www.farnell.com/datasheets/1716708.pdf
R?#14 R?#15 R?#19 R?#20 R?#22-R?#31 = Resistor 0805 10K: as R?#6 on sheet PSU; Supplier 1: Farnell; RoHS: YES; Pricing 1: 5000=0,001 (EUR); MSL: MSL 1 - Illimité; ComponentLink1URL: http://www.farnell.com/datasheets/1716700.pdf; ComponentLink1Description: http://www.farnell.com/datasheets/1716700.pdf; Supplier Part Number 1: 2129195

## Sheet MDB.SchDoc: MDB
size A4; Date: 19 08 2019; Author: Rachid AKKOUCHE; DrawnBy: Rachid AKKOUCHE; Engineer: Rachid AKKOUCHE; DocumentNumber: BRA201909261; Revision: II B; SheetNumber: 3; SheetTotal: 3; Telephone: +33651604047; Email: rachid.akkouche@wanadoo.fr; Proprietaire: Rachid AKKOUCHE; Dessinepar: -; Verifiepar: -; Property: Rachid AKKOUCHE; Time: 08:00
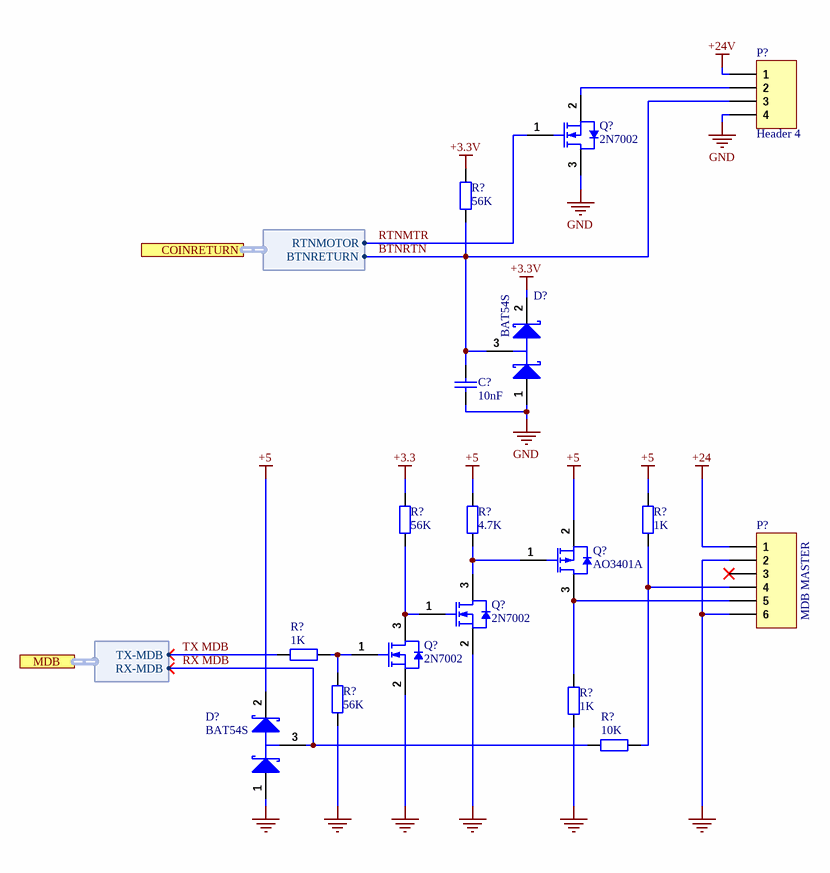
[diagram p2: MDB.SchDoc]

### Parts
(Parts that share a designator on the sheet are numbered #1, #2 ... from top to bottom, then left to right.)
C?#8  10nF  [C0805]
D?#5  BAT54S  [SOT23]
D?#6  BAT54S  [SOT23]
P?#3  Header 4  [Molex 22112042]
P?#4  MDB MASTER  [MOLEX 39-28-1063]
Q?#9  2N7002  [SOT23]
Q?#10  AO3401A  [SOT23]
Q?#11  2N7002  [SOT23]
Q?#12  2N7002  [SOT23]
R?#32  56K  [R0805]
R?#33  4.7K  [R 0805(2012)]
R?#34  1K  [R 0805(2012)]
R?#35  56K  [R 0805(2012)]
R?#36  1K  [R 0805(2012)]
R?#37  56K  [R 0805(2012)]
R?#38  1K  [R 0805(2012)]
R?#39  10K  [R 0805(2012)]

### Ports
COINRETURN (harness Return), MDB (harness MDB)

### Harnesses
MDB: RX-MDB, TX-MDB
Return: RTNMOTOR, BTNRETURN

### Nets
+3.3: R?#35.1
+3.3V: D?#5.2(K) R?#32.1
+5: D?#6.2(K) Q?#10.2(S) R?#33.2 R?#34.2
+24: P?#4.1
+24V: P?#3.1
GND: C?#8.2 D?#5.1(A) D?#6.1(A) P?#3.4 P?#4.2 P?#4.6 Q?#9.3(D) Q?#11.2(S) Q?#12.2(S) R?#37.1 R?#38.1
BTNRTN: C?#8.1 D?#5.3(C) P?#3.3 R?#32.2 ; port COINRETURN.BTNRETURN
RTNMTR: Q?#9.1(G) ; port COINRETURN.RTNMOTOR
RX MDB: D?#6.3(C) R?#39.2 ; port MDB.RX-MDB
TX MDB: R?#36.2 ; port MDB.TX-MDB
NetP?#3_2: P?#3.2 Q?#9.2(S)
NetP?#4_4: P?#4.4 R?#34.1 R?#39.1
NetP?#4_5: P?#4.5 Q?#10.3(D) R?#38.2
NetQ?#10_1: Q?#10.1(G) Q?#11.3(D) R?#33.1
NetQ?#11_1: Q?#11.1(G) Q?#12.3(D) R?#35.2
NetQ?#12_1: Q?#12.1(G) R?#36.1 R?#37.2

Not connected (* = marked no-connect by the designer): P?#4 3*

### Notes on the sheet
- Ce document est la propriété de
- Project:
- Il ne peut être divulgué sans l'accord écrit de l'un de ses représentants dûment mandaté
- Title:
- Number:
- Date:
- Time:
- Size:
- A4
- Revision:
- Sheet
- of
- 2, rue Georges MELIES
- Draw by:
- 78390 BOIS D'ARCY

### Library data of the parts
C?#8 = Cap 0805 100nF: Capacitor; Manufacturer: MULTICOMP; Manufacturer Part Number: MC0805F103Z500CT; Gamme de produit: Série MC; Capacité: 0.01; Tolérance de capacité: +80%, -20%; Diélectrique: Y5; Tension: 50; Boîtier de condensateur Céramique: 0805 [2012 Metric]; Température d'utilisation min: -30; Température de fonctionnement max..: 85; Type de packaging: Bande découpée; SVHC: No SVHC (15-Jun-2015); Bornes de condensateur: CMS; Température de fonctionnement: -30°C à +85; Tolérance de capacité ±: +80%, -20; Supplier 1: Farnell; Supplier Part Number 1: 1759247; RoHS: YES; Stock 1: 94719; Pricing 1: 10=0.0277, 250=0.025, 500=0.0222, 1000=0.0148, 2000=0.0111, 4000=0.0089, 20000=0.0059, 40000=0.0047 (EUR); MSL: -; ComponentLink1URL: http://www.farnell.com/datasheets/1901289.pdf; ComponentLink1Description: http://www.farnell.com/datasheets/1901289.pdf
D?#5 = BAT54S: Schottky Barrier Double Diode; Manufacturer: MULTICOMP; Courant, If moy.: 200; Tension, Vrrm: 30; Tension, Vf max..: 400; Temps trr max.: 5; Courant, Ifs max.: 600; Type de boîtier diode: SOT-23; Nombre de broches: 3; SVHC: No SVHC (19-Dec-2012); Configuration diode: Dual Series; Température, Tj max..: 150; Type de terminaison: SMD; Température d'utilisation min: -55; Courant, If, Vf: 10; Courant, Ir, max..: 2; Marquage, CMS: L44; Température de fonctionnement: -55°C à +150; Type de packaging: Bande découpée; Tension, direct à  If: 800; Supplier 1: Farnell; Supplier Part Number 1: 1621835; Manufacturer Part Number: BAT54S; RoHS: YES; Stock 1: 52055; Pricing 1: 10=0,102, 250=0,074, 1000=0,06, 3000=0,053 (EUR); Diode Type: Schottky; Type de boîtier: SOT-23; courant Ifsm: 600; ComponentLink1URL: http://www.farnell.com/datasheets/1317753.pdf; ComponentLink1Description: http://www.farnell.com/datasheets/1317753.pdf; Température de fonctionnement max..: 150; Supplier 2: Farnell; Supplier Part Number 2: 1467519; Stock 2: 11232; Pricing 2: 5=0,157, 90=0,066, 250=0,056, 750=0,0443, 1500=0,0388 (EUR); Type de boîtier de diode: SOT-23; MSL: MSL 1 - Illimité; Type de diode: Schottky; ComponentLink2URL: http://www.farnell.com/datasheets/1997854.pdf; ComponentLink2Description: http://www.farnell.com/datasheets/1997854.pdf
D?#6 = BAT54S: Schottky Barrier Double Diode; Manufacturer: MULTICOMP; Courant, If moy.: 200; Tension, Vrrm: 30; Tension, Vf max..: 400; Temps trr max.: 5; Courant, Ifs max.: 600; Type de boîtier diode: SOT-23; Nombre de broches: 3; SVHC: No SVHC (19-Dec-2012); Configuration diode: Dual Series; Température, Tj max..: 150; Type de terminaison: SMD; Température d'utilisation min: -55; Courant, If, Vf: 10; Courant, Ir, max..: 2; Marquage, CMS: L44; Température de fonctionnement: -55°C à +150; Supplier 1: Farnell; Supplier Part Number 1: 1621835; Manufacturer Part Number: BAT54S; RoHS: YES; Stock 1: 52055; Pricing 1: 10=0,102, 250=0,074, 1000=0,06, 3000=0,053 (EUR); Diode Type: Schottky; Type de boîtier: SOT-23; courant Ifsm: 600; ComponentLink1URL: http://www.farnell.com/datasheets/1317753.pdf; ComponentLink1Description: http://www.farnell.com/datasheets/1317753.pdf; Température de fonctionnement max..: 150
P?#3 = Header 4: Header, 4-Pin; Manufacturer: TE CONNECTIVITY / AMP; Manufacturer Part Number: 640454-4; Gamme de produit: Série MTA-100; Type de terminaison de contact: Traversant; Genre: Embase; Nombre de contacts: 4; Pas: 2.54; Plaquage du contact: Contacts plaqués étain; Matériau du contact: Alliage de cuivre; Nombre de rangées: 1; Méthode de terminaison: A souder; Tension nominale Vac: 250; Terminaison du contact: Traversant vertical<!--FANDB--><div class="features-and-benefits-container"><div class="features-and-benefits-description"><span class="features-benefits-value">The 640454-4 is a 4-position 1-row unshrouded Polarized Header with pin type tin-plated copper alloy straight posts, UL94V-0-rated glass-filled polyester housing and nickel-plated underplate. This vertical header is suitable for use with MTA-100 connector assembly.</span></div><div class="features-and-benefits-list"><ul class="features-and-benefits-list-list"><li class="features-and-benefits-list-item">250VAC Operating voltage</li><li class="features-and-benefits-list-item">5A Contact current rating</li><li class="features-and-benefits-list-item">UL94V-0 Flammability rating</li></ul></div><div class="features-and-benefits-applications"><ul class="features-and-benefits-value"><li class="features-and-benefits-list-item">Industrie</li></ul></div></div>; A utiliser avec: MTA .100 Headers & MTA .100 IDC Posted Connectors; Supplier 1: Farnell; Supplier Part Number 1: 588490; RoHS: YES; Stock 1: 22887; Pricing 1: 5=0.173, 50=0.0985, 500=0.0828, 1000=0.0599 (EUR); Courant: 4; Tension, fonctionnement: 250; ComponentLink1URL: http://www.farnell.com/datasheets/1667877.pdf; ComponentLink1Description: http://www.farnell.com/datasheets/1667877.pdf; ComponentLink2URL: http://www.farnell.com/cad/1650873.pdf; ComponentLink2Description: http://www.farnell.com/cad/1650873.pdf; ComponentLink3URL: http://www.farnell.com/datasheets/2007156.pdf; ComponentLink3Description: http://www.farnell.com/datasheets/2007156.pdf; Supplier 2: Farnell; Supplier Part Number 2: 2468503; Stock 2: 2449; Pricing 2: 10=0.31, 100=0.279, 500=0.251, 1000=0.226, 5000=0.203, 10000=0.183 (EUR); Nombre de Positions: 4; ComponentLink4URL: http://www.farnell.com/cad/1651660.pdf; ComponentLink4Description: http://www.farnell.com/cad/1651660.pdf
P?#4 = MOLEX 039281063: 6 Pin Vertical Header MINI FIT JR MOLEX PN 39281063 WITHOUT PEGS * Disc by Waytek; Max Voltage Rating (DC): 600.6kV; Current Rating: 9A; Voltage Rating: 600V; Max Current Rating: 3A; Number of Poles: 6; Voltage Rating (AC): 250V; Connector Type: Power,Rectangular; Gender: Male; Insulation Resistance: 1GR; Pitch: 4.2mm; Approvals: UL,CSA,TUV; Glow Wire Compliant: Non-compliant; Supplier 1: Farnell; Manufacturer 1: Molex; Manufacturer Part Number 1: 39-28-1063; RoHS: Yes; Category: Headers and Wire Housings; Stock 1: 11240; Mount: Through Hole; Contact Plating: Tin,Gold; Contact Material: Brass,Bronze; Color: Natural,Clear; Material: Nylon; Housing Color: Black; Housing Material: Nylon; Min Operating Temperature: -40°C; Max Operating Temperature: 105°C; Number of Rows: 2; Contact Gender: Male; Packaging: Bulk; Number of Positions: 6; Termination: Solder; Number of Contacts: 6; Working Voltage: 250V; Orientation: Straight; Voltage Rating (DC): 600V; Number of Circuits: 6; Length: 101.19mm; Height: 6.04mm; Lead Pitch: 4.2mm; Row Spacing: 4.2mm; Depth: 14.18mm; Radiation Hardening: No; REACH SVHC: Unknown; Halogen Free: Low Halogen; Lead Free: Lead Free; Flammability Rating: UL94 V-2; ComponentLink1URL: https://datasheet.ciiva.com/19462/1968769-19462120.pdf?src-supplier=Jameco; ComponentLink1Description: https://datasheet.ciiva.com/19462/1968769-19462120.pdf?src-supplier=Jameco; ComponentLink2URL: https://datasheet.ciiva.com/11748/0900766b80460da2-11748025.pdf?src-supplier=RSComponents; ComponentLink2Description: https://datasheet.ciiva.com/11748/0900766b80460da2-11748025.pdf?src-supplier=RSComponents; ComponentLink3URL: https://datasheet.ciiva.com/25908/0039281063-pcb-headers-25908512.pdf?src-supplier=Avnet+Europe; ComponentLink3Description: https://datasheet.ciiva.com/25908/0039281063-pcb-headers-25908512.pdf?src-supplier=Avnet+Europe; ComponentLink4URL: https://datasheet.ciiva.com/5152/0039281063-pcb-headers-228415-5152246.pdf?src-supplier=Mouser; ComponentLink4Description: https://datasheet.ciiva.com/5152/0039281063-pcb-headers-228415-5152246.pdf?src-supplier=Mouser; ComponentLink5URL: https://datasheet.ciiva.com/26916/getdatasheetpartid-292509-26916569.pdf?src-supplier=Verical; ComponentLink5Description: https://datasheet.ciiva.com/26916/getdatasheetpartid-292509-26916569.pdf?src-supplier=Verical; ComponentLink6URL: https://datasheet.ciiva.com/16468/0039281063-pcb-headers-16468972.pdf?src-supplier=Avnet+Asia; ComponentLink6Description: https://datasheet.ciiva.com/16468/0039281063-pcb-headers-16468972.pdf?src-supplier=Avnet+Asia; ComponentLink7URL: https://datasheet.ciiva.com/20209/22-3810e-20209534.pdf?src-supplier=Rapid+Electronics; ComponentLink7Description: https://datasheet.ciiva.com/20209/22-3810e-20209534.pdf?src-supplier=Rapid+Electronics; Supplier Part Number 1: 9732101
Q?#9 = 2N7002: N-channel Enhancement Mode Field-effect Transistor; Manufacturer: FAIRCHILD SEMICONDUCTOR; Supplier 1: Farnell; Supplier Part Number 1: 9512608; Manufacturer Part Number: 2N7002; RoHS: YES; Pricing 1: 5=0,138, 25=0,13, 100=0,059, 1000=0,049, 3000=0,026, 6000=0,0234 (EUR); ComponentLink1URL: http://www.farnell.com/datasheets/660093.pdf; ComponentLink1Description: http://www.farnell.com/datasheets/660093.pdf; ComponentLink2URL: http://www.farnell.com/datasheets/410597.pdf; ComponentLink2Description: http://www.farnell.com/datasheets/410597.pdf
Q?#10 = AO3401A: as Q?#1 on sheet PSU; Supplier 1: Arrow Electronics; Manufacturer Part Number: AO3401A; RoHS: Yes; Category: MOSFETs; Pricing 1: 6000=0,07860, 15000=0,06960, 30000=0,06870, 75000=0,05840, 150000=0,05610, 6000=0,08240, 60000=0,07800, 600000=0,05360, 3000000=0,04250, 6000000=0,04240 (USD); Mount: Surface Mount; Case/Package: TO-236-3; Number of Pins: 3; Min Operating Temperature: -55°C; Max Operating Temperature: 150°C; Packaging: Tape and Reel; Drain to Source Voltage (Vdss): 30V; Continuous Drain Current (ID): 4A; Power Dissipation: 1.4W; Series: -; Radiation Hardening: No; Lead Free: Lead Free; RoHS Compliant: Yes; ComponentLink1URL: https://datasheet.ciiva.com/940/ao3401a-940720.pdf?src-supplier=Digi-Key; ComponentLink1Description: https://datasheet.ciiva.com/940/ao3401a-940720.pdf?src-supplier=Digi-Key; ComponentLink2URL: https://datasheet.ciiva.com/26927/getdatasheetpartid-79048-26927888.pdf?src-supplier=Verical; ComponentLink2Description: https://datasheet.ciiva.com/26927/getdatasheetpartid-79048-26927888.pdf?src-supplier=Verical; Supplier Part Number 1: AO3401A
Q?#11 Q?#12 = 2N7002: as Q?#2 on sheet AFFICHEUR; ComponentLink1URL: http://www.farnell.com/datasheets/660093.pdf; ComponentLink1Description: http://www.farnell.com/datasheets/660093.pdf; ComponentLink2URL: http://www.farnell.com/datasheets/410597.pdf; ComponentLink2Description: http://www.farnell.com/datasheets/410597.pdf; Case/Package: SOT-23-3; Contact Plating: Tin; Current Rating: 115mA; Drain to Source Voltage (Vdss): 60V; Halogen Free: Halogen Free; Height: 1.01mm; Lead Free: Lead Free; Length: 3.04mm; Max Operating Temperature: 150°C; Min Operating Temperature: -55°C; Number of Elements: 1; Number of Pins: 3; On-State Resistance: 7.5R; Package Quantity: 1; Packaging: Tape and Reel; Radiation Hardening: No; Rds On Max: 7.5R; REACH SVHC: No SVHC; Threshold Voltage: 2.5V; Voltage Rating (DC): 60V; Width: 1.4mm; Supplier 1: TME; Supplier Part Number 1: 2N7002LT1G
R?#32 = Resistor 0805 56K: Resistor; Manufacturer: MULTICOMP; Manufacturer Part Number: MC01W0805556K; Supplier 1: Farnell; Supplier Part Number 1: 9334700; RoHS: Y-EX; Stock 1: 1329; Pricing 1: 10=0.0156, 250=0.0133, 500=0.0111, 1250=0.0088, 2500=0.0053, 5000=0.0038, 25000=0.0022, 50000=0.0019 (EUR); ComponentLink1URL: http://www.farnell.com/datasheets/1716700.pdf; ComponentLink1Description: http://www.farnell.com/datasheets/1716700.pdf
R?#33 = Resistor 0805 4.7K: as R?#2 on sheet PSU; Supplier 1: Farnell; RoHS: YES; Pricing 1: 5000=0,001 (EUR); MSL: (Non Applicable); ComponentLink1URL: http://www.farnell.com/datasheets/1729047.pdf; ComponentLink1Description: http://www.farnell.com/datasheets/1729047.pdf; Supplier Part Number 1: 2129167
R?#34 R?#36 R?#38 = Resistor 0805 1K: as R?#3 on sheet PSU; Supplier 1: Farnell; RoHS: YES; Pricing 1: 5000=0,001 (EUR); MSL: MSL 1 - Illimité; ComponentLink1URL: http://www.farnell.com/datasheets/1716700.pdf; ComponentLink1Description: http://www.farnell.com/datasheets/1716700.pdf; Supplier Part Number 1: 2129113
R?#35 R?#37 = Resistor 0805 56K: as R?#1 on sheet PSU; Supplier 1: Farnell; Supplier Part Number 1: 2129258; RoHS: YES; Pricing 1: 5000=0,001 (EUR); ComponentLink1URL: http://www.farnell.com/datasheets/1716700.pdf; ComponentLink1Description: http://www.farnell.com/datasheets/1716700.pdf; MSL: (Non Applicable)
R?#39 = Resistor 0805 10K: Resistor SMD 0805 10K; Manufacturer: MULTICOMP; Manufacturer Part Number: MC0.1W08051%10KFR; Résistance: 10; Puissance: 100; Tolérance de résistance: ± 1%; Tension: 150; Type de boîtier de résistance: 0805; Type de packaging: Full Reel; Type de résistance: Couche épaisse; Coefficient de température: ± 100; Product Range: MULTICOMP - MC Series; Resistor Mounting: CMS; Supplier 1: Farnell; Supplier Part Number 1: 2129195; RoHS: YES; Pricing 1: 5000=0,001 (EUR); MSL: MSL 1 - Illimité; ComponentLink1URL: http://www.farnell.com/datasheets/1716700.pdf; ComponentLink1Description: http://www.farnell.com/datasheets/1716700.pdf